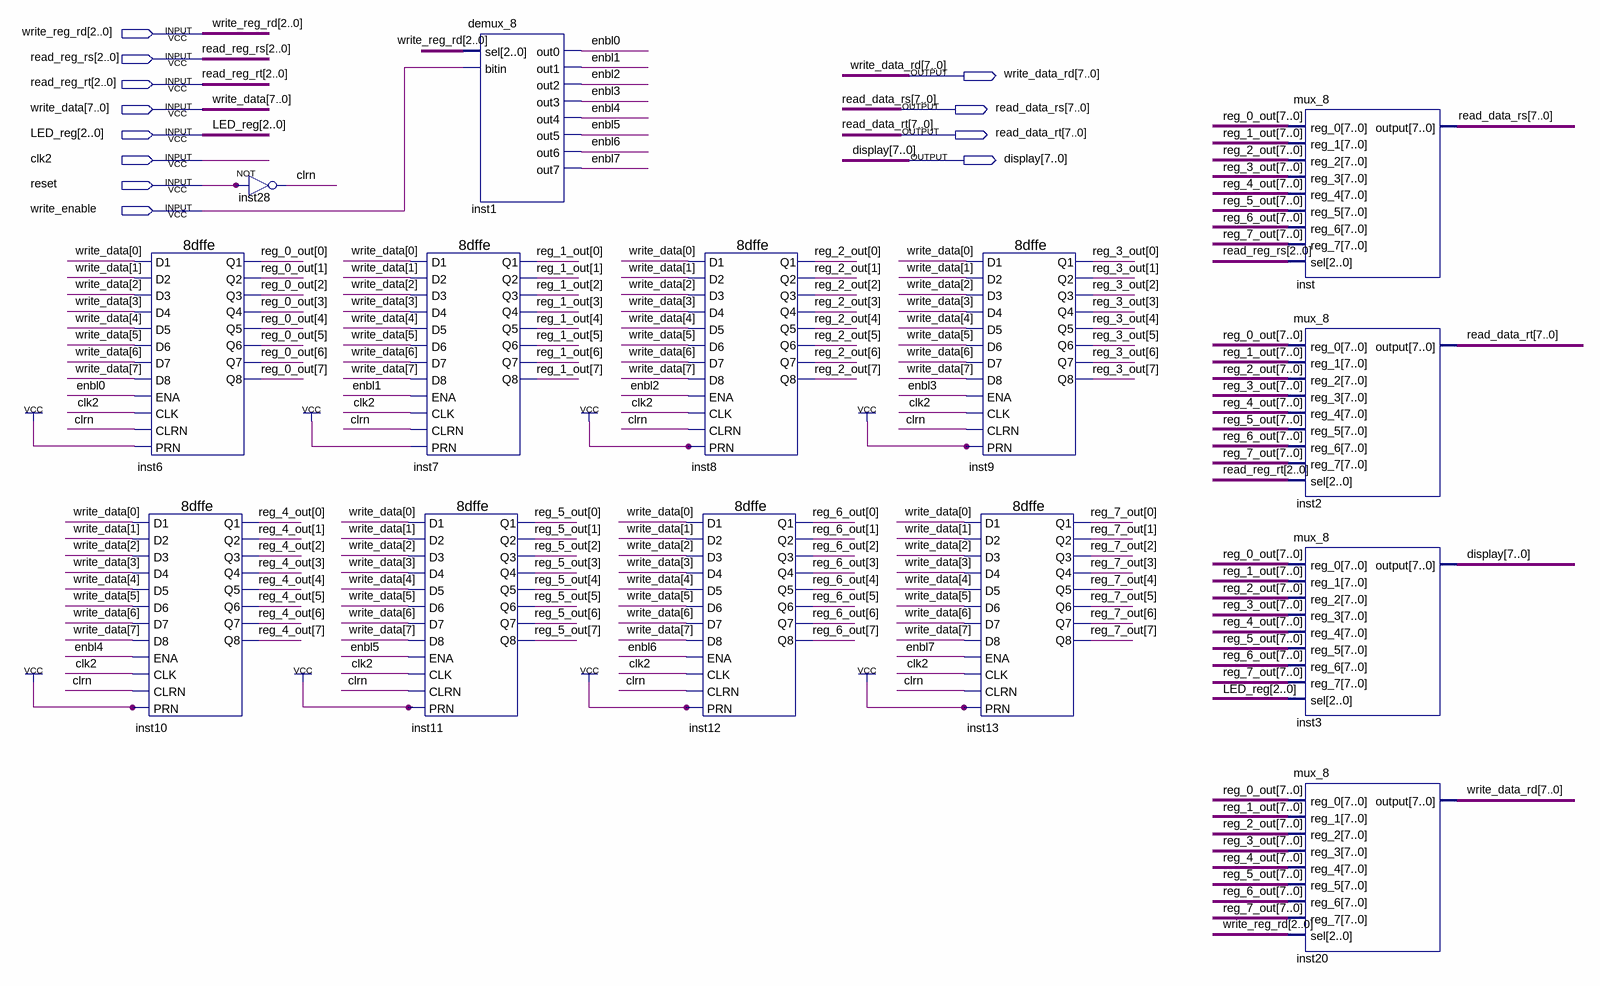
[diagram p0: schematic sheet]
// Quartus schematic reg_file.bdf as structural Verilog: 14 symbols, 12 pins
module reg_file (
  input  [2:0] write_reg_rd,
  input  [2:0] read_reg_rs,
  input  [2:0] read_reg_rt,
  input  [7:0] write_data,
  input  [2:0] LED_reg,
  input  clk2,
  input  reset,
  input  write_enable,
  output [7:0] write_data_rd,
  output [7:0] read_data_rs,
  output [7:0] read_data_rt,
  output [7:0] display
);

  wire clrn, enbl0, enbl1, enbl2, enbl3, enbl4, enbl5, enbl6, enbl7;
  wire [7:0] reg_0_out, reg_1_out, reg_2_out, reg_3_out, reg_4_out, reg_5_out, reg_6_out, reg_7_out;

  \8dffe  inst6 (
    .CLRN(clrn), .D2(write_data[1]), .D3(write_data[2]), .D4(write_data[3]), .D5(write_data[4]),
    .D8(write_data[7]), .D6(write_data[5]), .D7(write_data[6]), .CLK(clk2), .ENA(enbl0), .D1(write_data[0]),
    .PRN(1'b1), .Q8(reg_0_out[7]), .Q4(reg_0_out[3]), .Q6(reg_0_out[5]), .Q7(reg_0_out[6]),
    .Q3(reg_0_out[2]), .Q2(reg_0_out[1]), .Q1(reg_0_out[0]), .Q5(reg_0_out[4]));
  \8dffe  inst10 (
    .CLRN(clrn), .D2(write_data[1]), .D3(write_data[2]), .D4(write_data[3]), .D5(write_data[4]),
    .D8(write_data[7]), .D6(write_data[5]), .D7(write_data[6]), .CLK(clk2), .ENA(enbl4), .D1(write_data[0]),
    .PRN(1'b1), .Q8(reg_4_out[7]), .Q4(reg_4_out[3]), .Q6(reg_4_out[5]), .Q7(reg_4_out[6]),
    .Q3(reg_4_out[2]), .Q2(reg_4_out[1]), .Q1(reg_4_out[0]), .Q5(reg_4_out[4]));
  not inst28 (clrn, reset);
  \8dffe  inst7 (
    .CLRN(clrn), .D2(write_data[1]), .D3(write_data[2]), .D4(write_data[3]), .D5(write_data[4]),
    .D8(write_data[7]), .D6(write_data[5]), .D7(write_data[6]), .CLK(clk2), .ENA(enbl1), .D1(write_data[0]),
    .PRN(1'b1), .Q8(reg_1_out[7]), .Q4(reg_1_out[3]), .Q6(reg_1_out[5]), .Q7(reg_1_out[6]),
    .Q3(reg_1_out[2]), .Q2(reg_1_out[1]), .Q1(reg_1_out[0]), .Q5(reg_1_out[4]));
  \8dffe  inst11 (
    .CLRN(clrn), .D2(write_data[1]), .D3(write_data[2]), .D4(write_data[3]), .D5(write_data[4]),
    .D8(write_data[7]), .D6(write_data[5]), .D7(write_data[6]), .CLK(clk2), .ENA(enbl5), .D1(write_data[0]),
    .PRN(1'b1), .Q8(reg_5_out[7]), .Q4(reg_5_out[3]), .Q6(reg_5_out[5]), .Q7(reg_5_out[6]),
    .Q3(reg_5_out[2]), .Q2(reg_5_out[1]), .Q1(reg_5_out[0]), .Q5(reg_5_out[4]));
  demux_8 inst1 (
    .sel(write_reg_rd), .bitin(write_enable), .out0(enbl0), .out1(enbl1), .out2(enbl2), .out3(enbl3),
    .out4(enbl4), .out5(enbl5), .out6(enbl6), .out7(enbl7));
  \8dffe  inst8 (
    .CLRN(clrn), .D2(write_data[1]), .D3(write_data[2]), .D4(write_data[3]), .D5(write_data[4]),
    .D8(write_data[7]), .D6(write_data[5]), .D7(write_data[6]), .CLK(clk2), .ENA(enbl2), .D1(write_data[0]),
    .PRN(1'b1), .Q8(reg_2_out[7]), .Q4(reg_2_out[3]), .Q6(reg_2_out[5]), .Q7(reg_2_out[6]),
    .Q3(reg_2_out[2]), .Q2(reg_2_out[1]), .Q1(reg_2_out[0]), .Q5(reg_2_out[4]));
  \8dffe  inst12 (
    .CLRN(clrn), .D2(write_data[1]), .D3(write_data[2]), .D4(write_data[3]), .D5(write_data[4]),
    .D8(write_data[7]), .D6(write_data[5]), .D7(write_data[6]), .CLK(clk2), .ENA(enbl6), .D1(write_data[0]),
    .PRN(1'b1), .Q8(reg_6_out[7]), .Q4(reg_6_out[3]), .Q6(reg_6_out[5]), .Q7(reg_6_out[6]),
    .Q3(reg_6_out[2]), .Q2(reg_6_out[1]), .Q1(reg_6_out[0]), .Q5(reg_6_out[4]));
  \8dffe  inst9 (
    .CLRN(clrn), .D2(write_data[1]), .D3(write_data[2]), .D4(write_data[3]), .D5(write_data[4]),
    .D8(write_data[7]), .D6(write_data[5]), .D7(write_data[6]), .CLK(clk2), .ENA(enbl3), .D1(write_data[0]),
    .PRN(1'b1), .Q8(reg_3_out[7]), .Q4(reg_3_out[3]), .Q6(reg_3_out[5]), .Q7(reg_3_out[6]),
    .Q3(reg_3_out[2]), .Q2(reg_3_out[1]), .Q1(reg_3_out[0]), .Q5(reg_3_out[4]));
  \8dffe  inst13 (
    .CLRN(clrn), .D2(write_data[1]), .D3(write_data[2]), .D4(write_data[3]), .D5(write_data[4]),
    .D8(write_data[7]), .D6(write_data[5]), .D7(write_data[6]), .CLK(clk2), .ENA(enbl7), .D1(write_data[0]),
    .PRN(1'b1), .Q8(reg_7_out[7]), .Q4(reg_7_out[3]), .Q6(reg_7_out[5]), .Q7(reg_7_out[6]),
    .Q3(reg_7_out[2]), .Q2(reg_7_out[1]), .Q1(reg_7_out[0]), .Q5(reg_7_out[4]));
  mux_8 inst (
    .reg_0(reg_0_out), .reg_1(reg_1_out), .reg_2(reg_2_out), .reg_3(reg_3_out), .reg_4(reg_4_out),
    .reg_5(reg_5_out), .reg_6(reg_6_out), .reg_7(reg_7_out), .sel(read_reg_rs), .\output (read_data_rs));
  mux_8 inst2 (
    .reg_0(reg_0_out), .reg_1(reg_1_out), .reg_2(reg_2_out), .reg_3(reg_3_out), .reg_4(reg_4_out),
    .reg_5(reg_5_out), .reg_6(reg_6_out), .reg_7(reg_7_out), .sel(read_reg_rt), .\output (read_data_rt));
  mux_8 inst3 (
    .reg_0(reg_0_out), .reg_1(reg_1_out), .reg_2(reg_2_out), .reg_3(reg_3_out), .reg_4(reg_4_out),
    .reg_5(reg_5_out), .reg_6(reg_6_out), .reg_7(reg_7_out), .sel(LED_reg), .\output (display));
  mux_8 inst20 (
    .reg_0(reg_0_out), .reg_1(reg_1_out), .reg_2(reg_2_out), .reg_3(reg_3_out), .reg_4(reg_4_out),
    .reg_5(reg_5_out), .reg_6(reg_6_out), .reg_7(reg_7_out), .sel(write_reg_rd), .\output (write_data_rd));
endmodule
